# Altium project ColorSS_Module_v2.PrjPcb
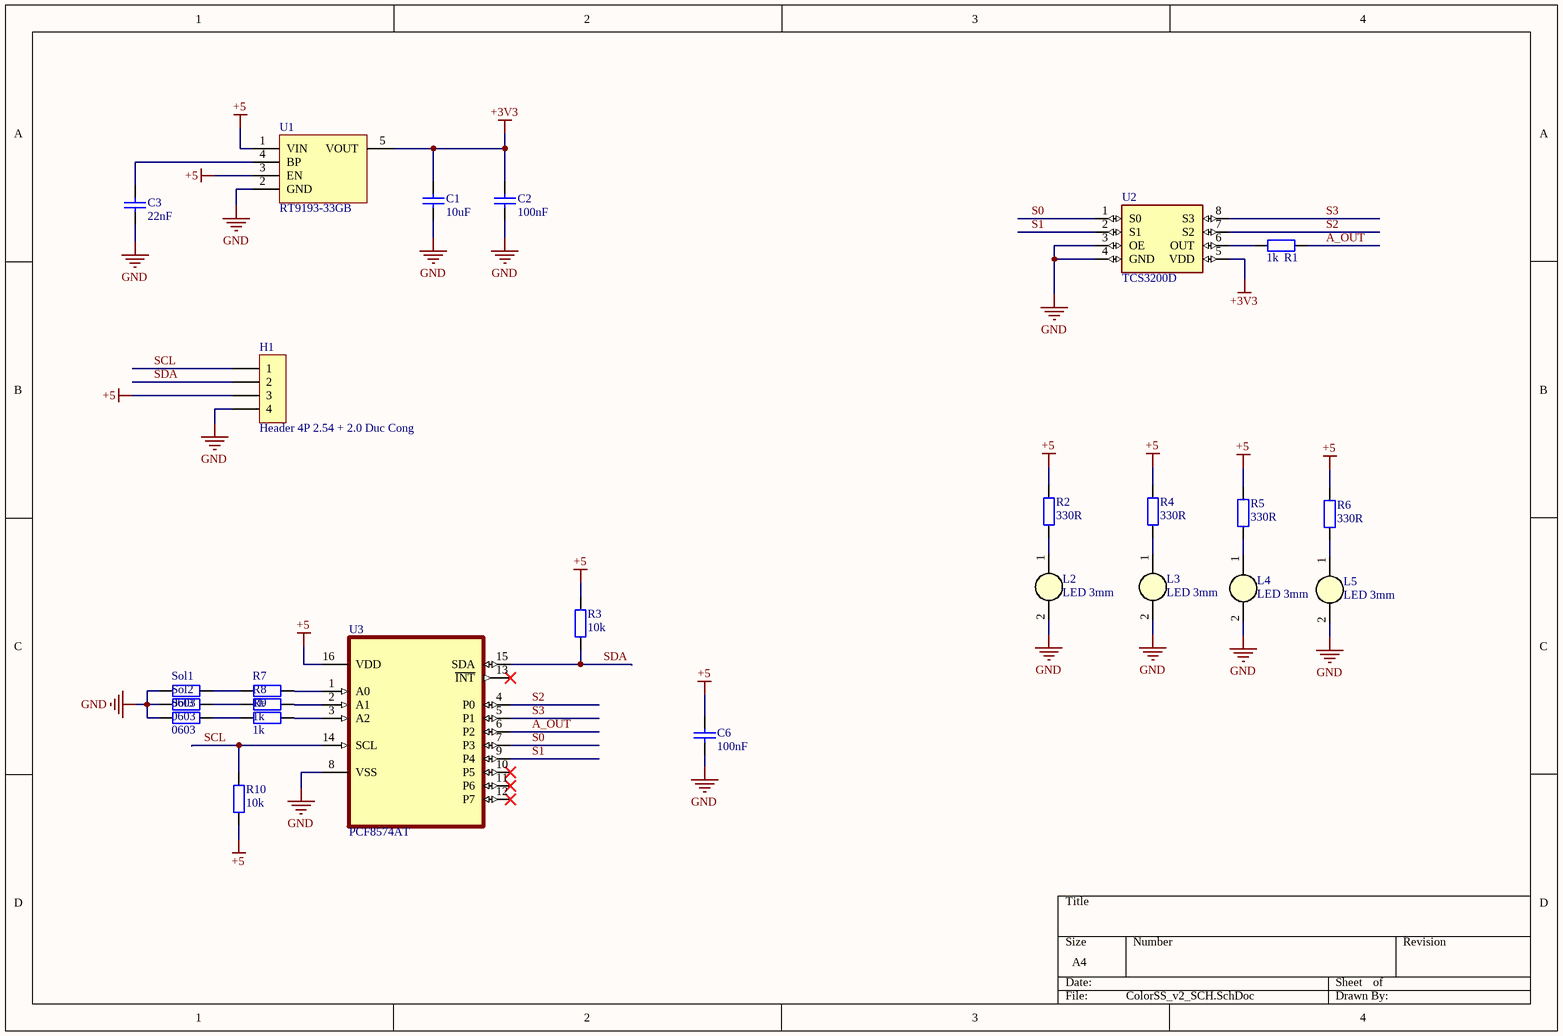
[diagram p0: ColorSS_v2_SCH.SchDoc]
1 sheet, 25 parts. Net scope: global (net labels, ports and power ports of the same name join across sheets).
Board file: ColorSS_v2_PCB.PcbDoc

## Sheet ColorSS_v2_SCH.SchDoc
size A4; SheetNumber: 1; SheetTotal: 1

### Parts
C1  10uF  [tu 0603]
C2  100nF  [tu 0603]
C3  22nF  [tu 0603]
C6  100nF  [tu 0603]
H1  Header 4P 2.54 + 2.0 Duc Cong  [Header 4P DC 2.54 + 2.0]
L2  LED 3mm  [LED-3MM-WHITE]
L3  LED 3mm  [LED-3MM-WHITE]
L4  LED 3mm  [LED-3MM-WHITE]
L5  LED 3mm  [LED-3MM-WHITE]
R1  1k  [tro smd 0603]
R2  330R  [tro smd 0603]
R3  10k  [tro smd 0603]
R4  330R  [tro smd 0603]
R5  330R  [tro smd 0603]
R6  330R  [tro smd 0603]
R7  1k  [tro smd 0603]
R8  1k  [tro smd 0603]
R9  1k  [tro smd 0603]
R10  10k  [tro smd 0603]
Sol1  0603  [Solder 0603]
Sol2  0603  [Solder 0603]
Sol3  0603  [Solder 0603]
U1  RT9193-33GB  [SOT23-5]
U2  TCS3200D  [SOIC8]
U3  PCF8574AT  [SOIC127P1032X265-16N]

### Nets
+3V3: C1.1 C2.1 U1.5(VOUT) U2.5(VDD)
+5: C6.1 H1.3 R2.2 R3.2 R4.2 R5.2 R6.2 R10.2 U1.1(VIN) U1.3(EN) U3.16(VDD)
GND: C1.2 C2.2 C3.2 C6.2 H1.4 L2.2(K) L3.2(K) L4.2(K) L5.2(K) Sol1.1 Sol2.1 Sol3.1 U1.2(GND) U2.3(OE) U2.4(GND) U3.8(VSS)
A_OUT: R1.2 U3.6(P2)
S0: U2.1(S0) U3.7(P3)
S1: U2.2(S1) U3.9(P4)
S2: U2.7(S2) U3.4(P0)
S3: U2.8(S3) U3.5(P1)
SCL: H1.1 R10.1 U3.14(SCL)
SDA: H1.2 R3.1 U3.15(SDA)
NetC3_1: C3.1 U1.4(BP)
NetL2_1: L2.1(A) R2.1
NetL3_1: L3.1(A) R4.1
NetL4_1: L4.1(A) R5.1
NetL5_1: L5.1(A) R6.1
NetR1_1: R1.1 U2.6(OUT)
NetR7_1: R7.1 Sol1.2
NetR7_2: R7.2 U3.1(A0)
NetR8_1: R8.1 Sol2.2
NetR8_2: R8.2 U3.2(A1)
NetR9_1: R9.1 Sol3.2
NetR9_2: R9.2 U3.3(A2)

Not connected (* = marked no-connect by the designer): U3 10(P5)* 11(P6)* 12(P7)* 13(~{INT})*

### Library data of the parts
C1 = Tu 0603 106 16V 20%: Dán; Don_Vi: Con; So_Chan: 2; Ten_Linh_Kien: Tụ 0603-10uF 20% 16V; Ma_Hang: MH004848; Chung_Loai: Dán; Kieu_Chan: *
C2 C3 C6 = Tu 0603 104 50V 10%: Dán; Don_Vi: Con; So_Chan: 2; Ten_Linh_Kien: Tụ 0603 104-100nF 10% 50V; Ma_Hang: MH004568; Chung_Loai: Dán; Kieu_Chan: *
H1 = Header 4P 2.54 + 2.0 Duc Cong: Cắm; Ten_Linh_Kien: Header 4P XH2.54-4P Đực Cong; Don_Vi: Con; Ma_Hang: MH001310; Chung_Loai: Cắm
L2-L5 = LED 3mm Trang: Cắm; Don_Vi: Con; Ma_Hang: MH009001; Ten_Linh_Kien: LED 3MM Trắng SS (1000c); Ghi_Chu: *; Kieu_Chan: *; Chung_Loai: Cắm
R1 R7-R9 = Tro 0603 1% 1k: Dán; So_Chan: 2; Don_Vi: Con; Ten_Linh_Kien: Trở 0603 1% 1k; Ma_Hang: MH006334; Chung_Loai: Dán; Kieu_Chan: *
R2-R6 R10 = Tro 0603 5% 330R: Dán; Don_Vi: Con; Ma_Hang: MH006910; So_Chan: 2; Ten_Linh_Kien: Trở 0603 5% 330R; Chung_Loai: Dán; Kieu_Chan: *
Sol1-Sol3 = Solder 0603: Dán; So_Chan: 2; Don_Vi: Con; Ten_Linh_Kien: Chân hàn 0603; Chung_Loai: Dán; Kieu_Chan: *
U1 = REG_5.5V-3.3V-0.3A-1W-SOT-23-5: Linear Voltage Regulator IC 1 Output 300mA SOT-23-5; Manufacturer: Richtek USA Inc.; Alternate Part Number-1: NA; Manufacturer Part Number: RT9193-33GB; Supplier-1: LCSC; Supplier Part Number-1: C15651; Case/Package: SOT-23-5
U2 = TCS3200D: Color Sensor - Auto Power Down 8-SOIC (0.154, 3.90mm Width); MF: ams; SnapEDA_Link: https://www.snapeda.com/parts/TCS3200D/ams/view-part/?ref=snap; Package: SOIC-8 ams; Value: *; MP: TCS3200D; Check_prices: https://www.snapeda.com/parts/TCS3200D/ams/view-part/?ref=eda
U3 = PCF8574AT: IÂ²C Bus IC Operating temperature: -40...+85 Â°C Power supply: 2.5...6 V Package: SO-16W; MF: NXP USA; SnapEDA_Link: https://www.snapeda.com/parts/PCF8574AT/NXP+Semiconductors/view-part/?ref=snap; Package: SOIC-16 NXP Semiconductors; Value: *; MP: PCF8574AT; Check_prices: https://www.snapeda.com/parts/PCF8574AT/NXP+Semiconductors/view-part/?ref=eda